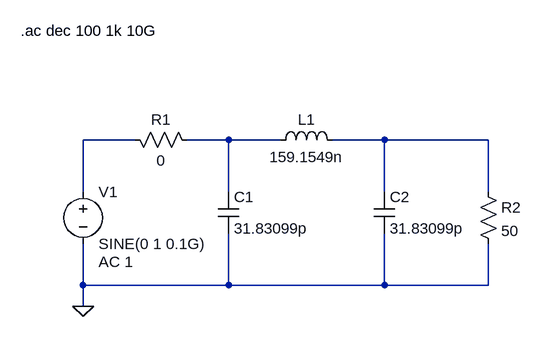
[diagram p0: schematic butterworth_lc_pi_filter.asc]
butterworth_lc_pi_filter.asc, the LTspice schematic file:
Version 4
SHEET 1 1000 680
WIRE 320 64 240 64
WIRE 464 64 400 64
WIRE 544 64 464 64
WIRE 704 64 624 64
WIRE 864 64 704 64
WIRE 240 144 240 64
WIRE 464 144 464 64
WIRE 704 144 704 64
WIRE 864 144 864 64
WIRE 240 288 240 224
WIRE 464 288 464 208
WIRE 464 288 240 288
WIRE 704 288 704 208
WIRE 704 288 464 288
WIRE 864 288 864 224
WIRE 864 288 704 288
WIRE 240 320 240 288
FLAG 240 320 0
SYMBOL voltage 240 128 R0
WINDOW 123 24 124 Left 2
WINDOW 39 0 0 Left 0
SYMATTR InstName V1
SYMATTR Value SINE(0 1 0.1G)
SYMATTR Value2 AC 1
SYMBOL cap 448 144 R0
SYMATTR InstName C1
SYMATTR Value 31.83099p
SYMBOL cap 688 144 R0
SYMATTR InstName C2
SYMATTR Value 31.83099p
SYMBOL ind 528 80 R270
WINDOW 0 32 56 VTop 2
WINDOW 3 5 56 VBottom 2
SYMATTR InstName L1
SYMATTR Value 159.1549n
SYMBOL res 304 48 M90
WINDOW 0 0 56 VBottom 2
WINDOW 3 32 56 VTop 2
SYMATTR InstName R1
SYMATTR Value 0
SYMBOL res 848 128 R0
SYMATTR InstName R2
SYMATTR Value 50
TEXT 144 -104 Left 2 !.ac dec 100 1k 10G

The netlist it stands for:
* butterworth_lc_pi_filter.asc
V1 N001 0 SINE(0 1 0.1G) AC 1
C1 N002 0 31.83099p
C2 N003 0 31.83099p
L1 N002 N003 159.1549n
R1 N001 N002 0
R2 N003 0 50
.ac dec 100 1k 10G
.backanno
.end